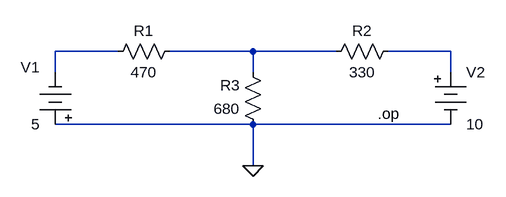
[diagram p0: schematic KCL.asc]
KCL.asc, the LTspice schematic file:
Version 4
SHEET 1 880 680
WIRE 16 96 -80 96
WIRE 224 96 96 96
WIRE 352 96 224 96
WIRE 528 96 432 96
WIRE -80 128 -80 96
WIRE 224 128 224 96
WIRE 528 128 528 96
WIRE 224 208 -80 208
WIRE 528 208 224 208
WIRE 224 272 224 208
FLAG 224 272 0
DATAFLAG -48 96 "$-V(N002)"
DATAFLAG 224 96 ""
DATAFLAG 352 96 "$-V(N003)"
SYMBOL res 112 80 R90
WINDOW 0 0 56 VBottom 2
WINDOW 3 32 56 VTop 2
SYMATTR InstName R1
SYMATTR Value 470
SYMBOL res 448 80 R90
WINDOW 0 0 56 VBottom 2
WINDOW 3 32 56 VTop 2
SYMATTR InstName R2
SYMATTR Value 330
SYMBOL res 240 224 R180
WINDOW 0 36 76 Left 2
WINDOW 3 36 40 Left 2
SYMATTR InstName R3
SYMATTR Value 680
SYMBOL Misc\\battery -80 224 R180
WINDOW 0 24 104 Left 2
WINDOW 3 24 16 Left 2
SYMATTR InstName V1
SYMATTR Value 5
SYMBOL Misc\\battery 528 112 R0
SYMATTR InstName V2
SYMATTR Value 10
TEXT 416 192 Left 2 !.op

The netlist it stands for:
* KCL.asc
R1 N002 N001 470
R2 N003 N002 330
R3 0 N002 680
V1 0 N001 5
V2 N003 0 10
.op
.backanno
.end